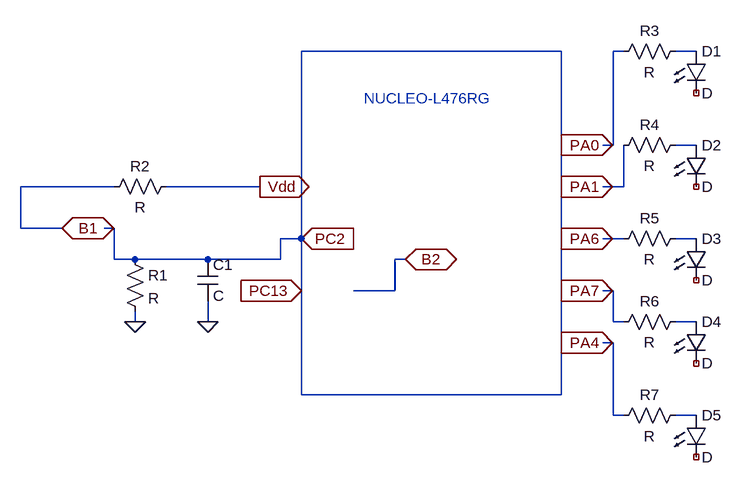
[diagram p0: schematic Light-Chaser-Schematic.asc]
Light-Chaser-Schematic.asc, the LTspice schematic file:
Version 4.1
SHEET 1 1836 680
WIRE 1568 -48 1168 -48
WIRE 1664 -48 1648 -48
WIRE 1776 -48 1744 -48
WIRE 1568 96 1568 -48
WIRE 1648 96 1648 -48
WIRE 1648 96 1632 96
WIRE 1776 96 1744 96
WIRE 880 160 736 160
WIRE 1104 160 960 160
WIRE 1568 160 1568 96
WIRE 1664 160 1664 96
WIRE 1664 160 1632 160
WIRE 736 224 736 160
WIRE 800 224 736 224
WIRE 880 224 864 224
WIRE 1168 240 1168 -48
WIRE 1168 240 1136 240
WIRE 1568 240 1568 160
WIRE 1664 240 1632 240
WIRE 1776 240 1744 240
WIRE 880 272 880 224
WIRE 912 272 880 272
WIRE 1024 272 912 272
WIRE 1136 272 1136 240
WIRE 1136 272 1024 272
WIRE 1328 272 1312 272
WIRE 1168 320 1168 240
WIRE 1312 320 1312 272
WIRE 1312 320 1248 320
WIRE 1568 320 1568 240
WIRE 1648 320 1632 320
WIRE 912 368 912 352
WIRE 1024 368 1024 336
WIRE 1648 368 1648 320
WIRE 1664 368 1648 368
WIRE 1776 368 1744 368
WIRE 1568 400 1568 320
WIRE 1648 400 1632 400
WIRE 1168 480 1168 320
WIRE 1568 480 1568 400
WIRE 1568 480 1168 480
WIRE 1648 512 1648 400
WIRE 1664 512 1648 512
WIRE 1776 512 1744 512
FLAG 1168 240 PC2
IOPIN 1168 240 In
FLAG 1168 320 PC13
IOPIN 1168 320 In
FLAG 1568 96 PA0
IOPIN 1568 96 Out
FLAG 1568 160 PA1
IOPIN 1568 160 Out
FLAG 1568 240 PA6
IOPIN 1568 240 Out
FLAG 1568 320 PA7
IOPIN 1568 320 Out
FLAG 1568 400 PA4
IOPIN 1568 400 Out
FLAG 1104 160 Vdd
IOPIN 1104 160 Out
FLAG 1024 368 0
FLAG 912 368 0
FLAG 800 224 B1
IOPIN 800 224 BiDir
FLAG 1328 272 B2
IOPIN 1328 272 BiDir
SYMBOL cap 1008 272 R0
SYMATTR InstName C1
SYMBOL res 896 256 R0
SYMATTR InstName R1
SYMBOL LED 1760 -48 R0
SYMATTR InstName D1
SYMBOL LED 1760 96 R0
SYMATTR InstName D2
SYMBOL LED 1760 240 R0
SYMATTR InstName D3
SYMBOL LED 1760 368 R0
SYMATTR InstName D4
SYMBOL LED 1760 512 R0
SYMATTR InstName D5
SYMBOL res 976 144 R90
WINDOW 0 0 56 VBottom 2
WINDOW 3 32 56 VTop 2
SYMATTR InstName R2
SYMBOL res 1760 -64 R90
WINDOW 0 0 56 VBottom 2
WINDOW 3 32 56 VTop 2
SYMATTR InstName R3
SYMBOL res 1760 80 R90
WINDOW 0 0 56 VBottom 2
WINDOW 3 32 56 VTop 2
SYMATTR InstName R4
SYMBOL res 1760 224 R90
WINDOW 0 0 56 VBottom 2
WINDOW 3 32 56 VTop 2
SYMATTR InstName R5
SYMBOL res 1760 352 R90
WINDOW 0 0 56 VBottom 2
WINDOW 3 32 56 VTop 2
SYMATTR InstName R6
SYMBOL res 1760 496 R90
WINDOW 0 0 56 VBottom 2
WINDOW 3 32 56 VTop 2
SYMATTR InstName R7
TEXT 1264 24 Left 2 ;NUCLEO-L476RG

The netlist it stands for:
* Light-Chaser-Schematic.asc
C1 PA4 0 C
R1 PA4 0 R
D1 N002 NC_01 D
D2 N003 NC_02 D
D3 N006 NC_03 D
D4 N008 NC_04 D
D5 N010 NC_05 D
R2 Vdd B1 R
R3 N002 N001 R
R4 N003 N004 R
R5 N006 N005 R
R6 N008 N007 R
R7 N010 N009 R
.model D D
.lib standard.dio
* NUCLEO-L476RG
.backanno
.end